# EasyEDA Pro project SchadenDeck.eprj, board keebdeck_basic_faceplate
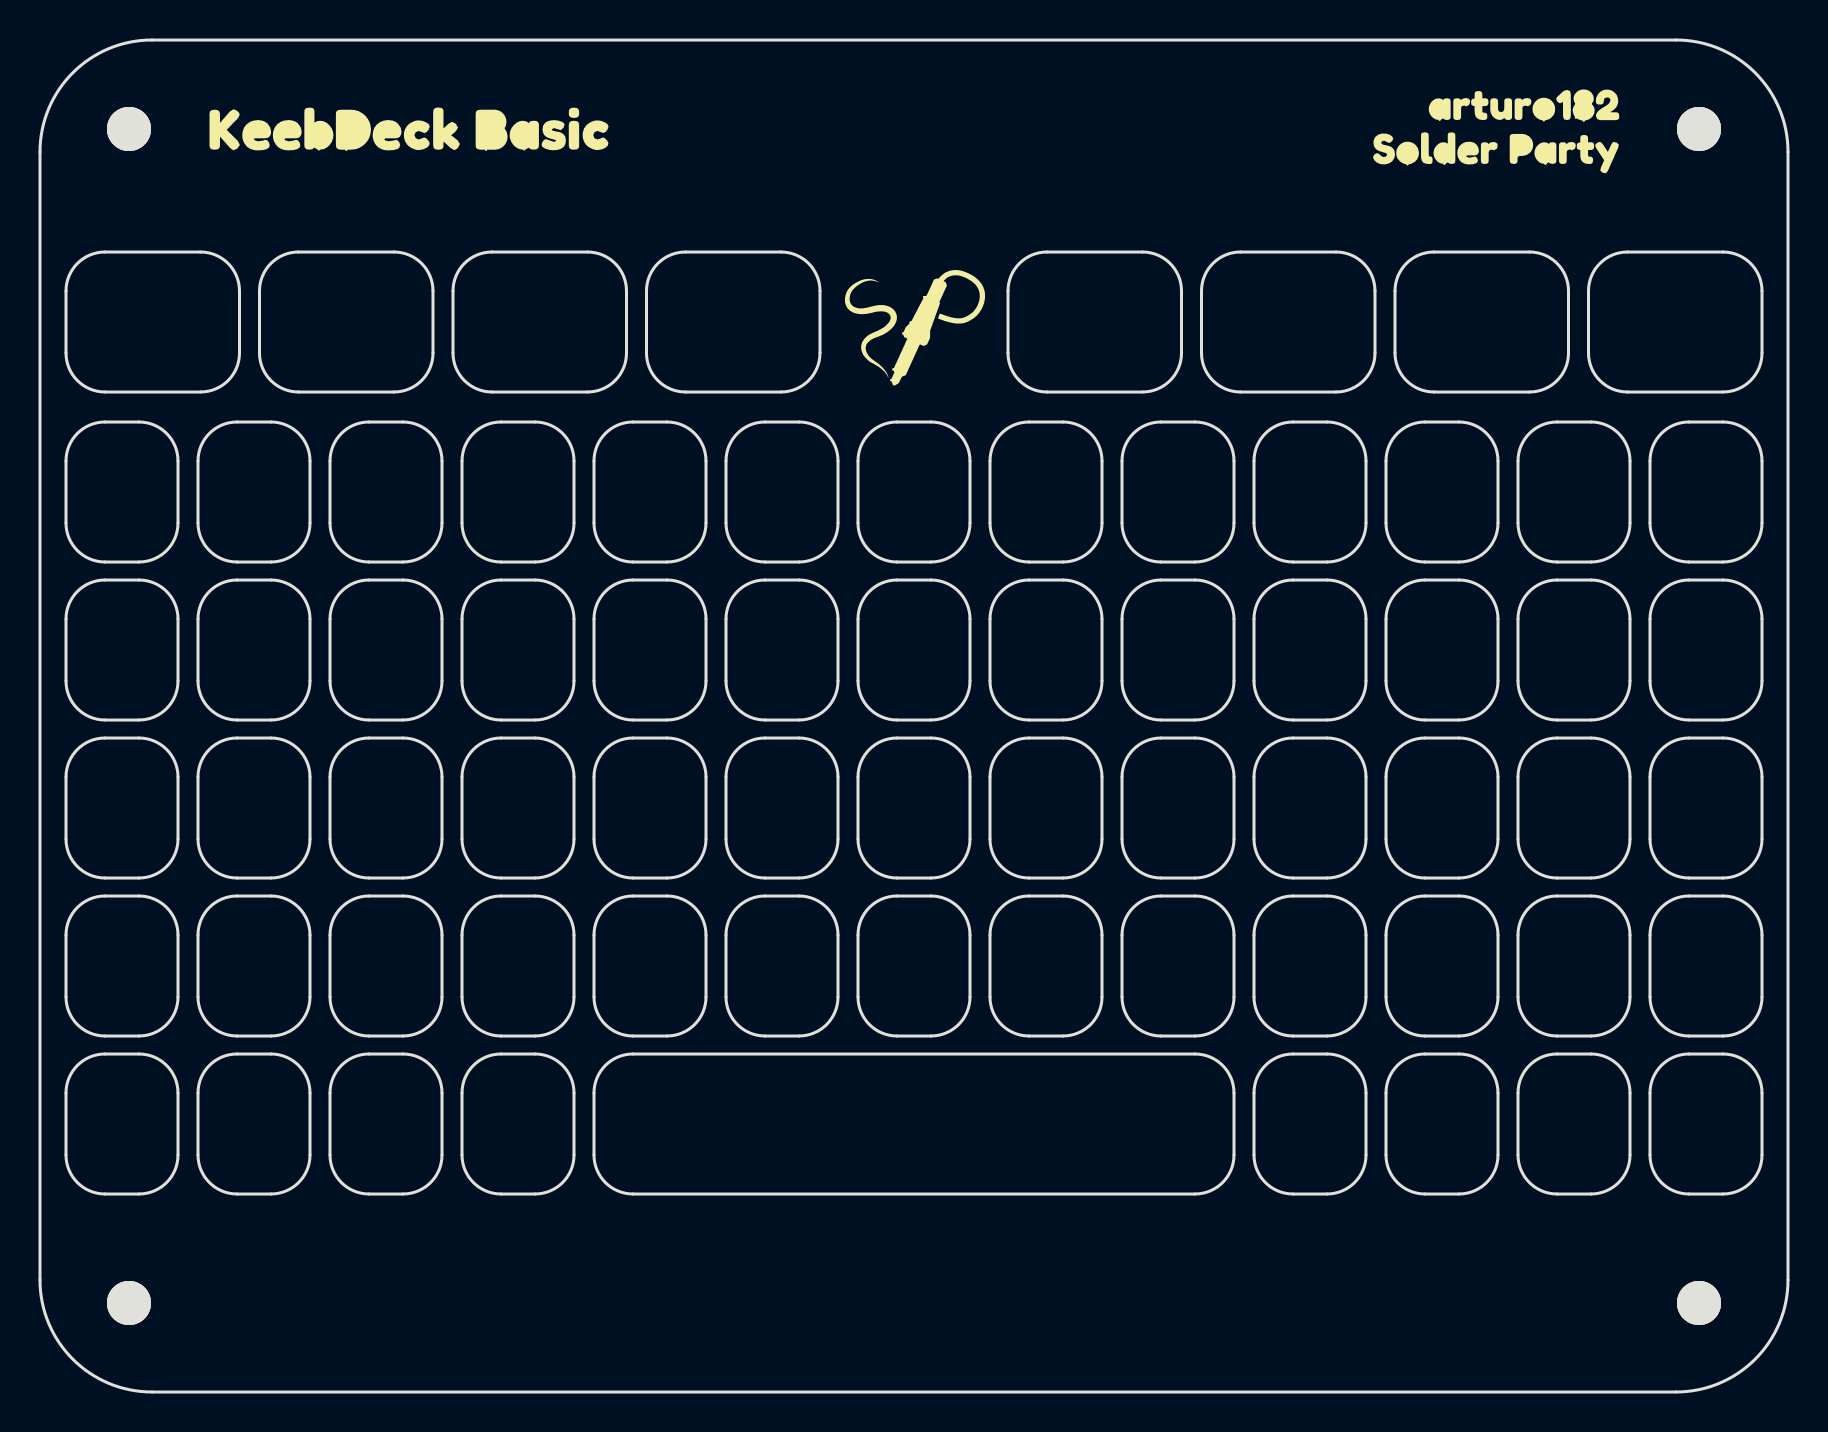
[diagram p6: board, top side]
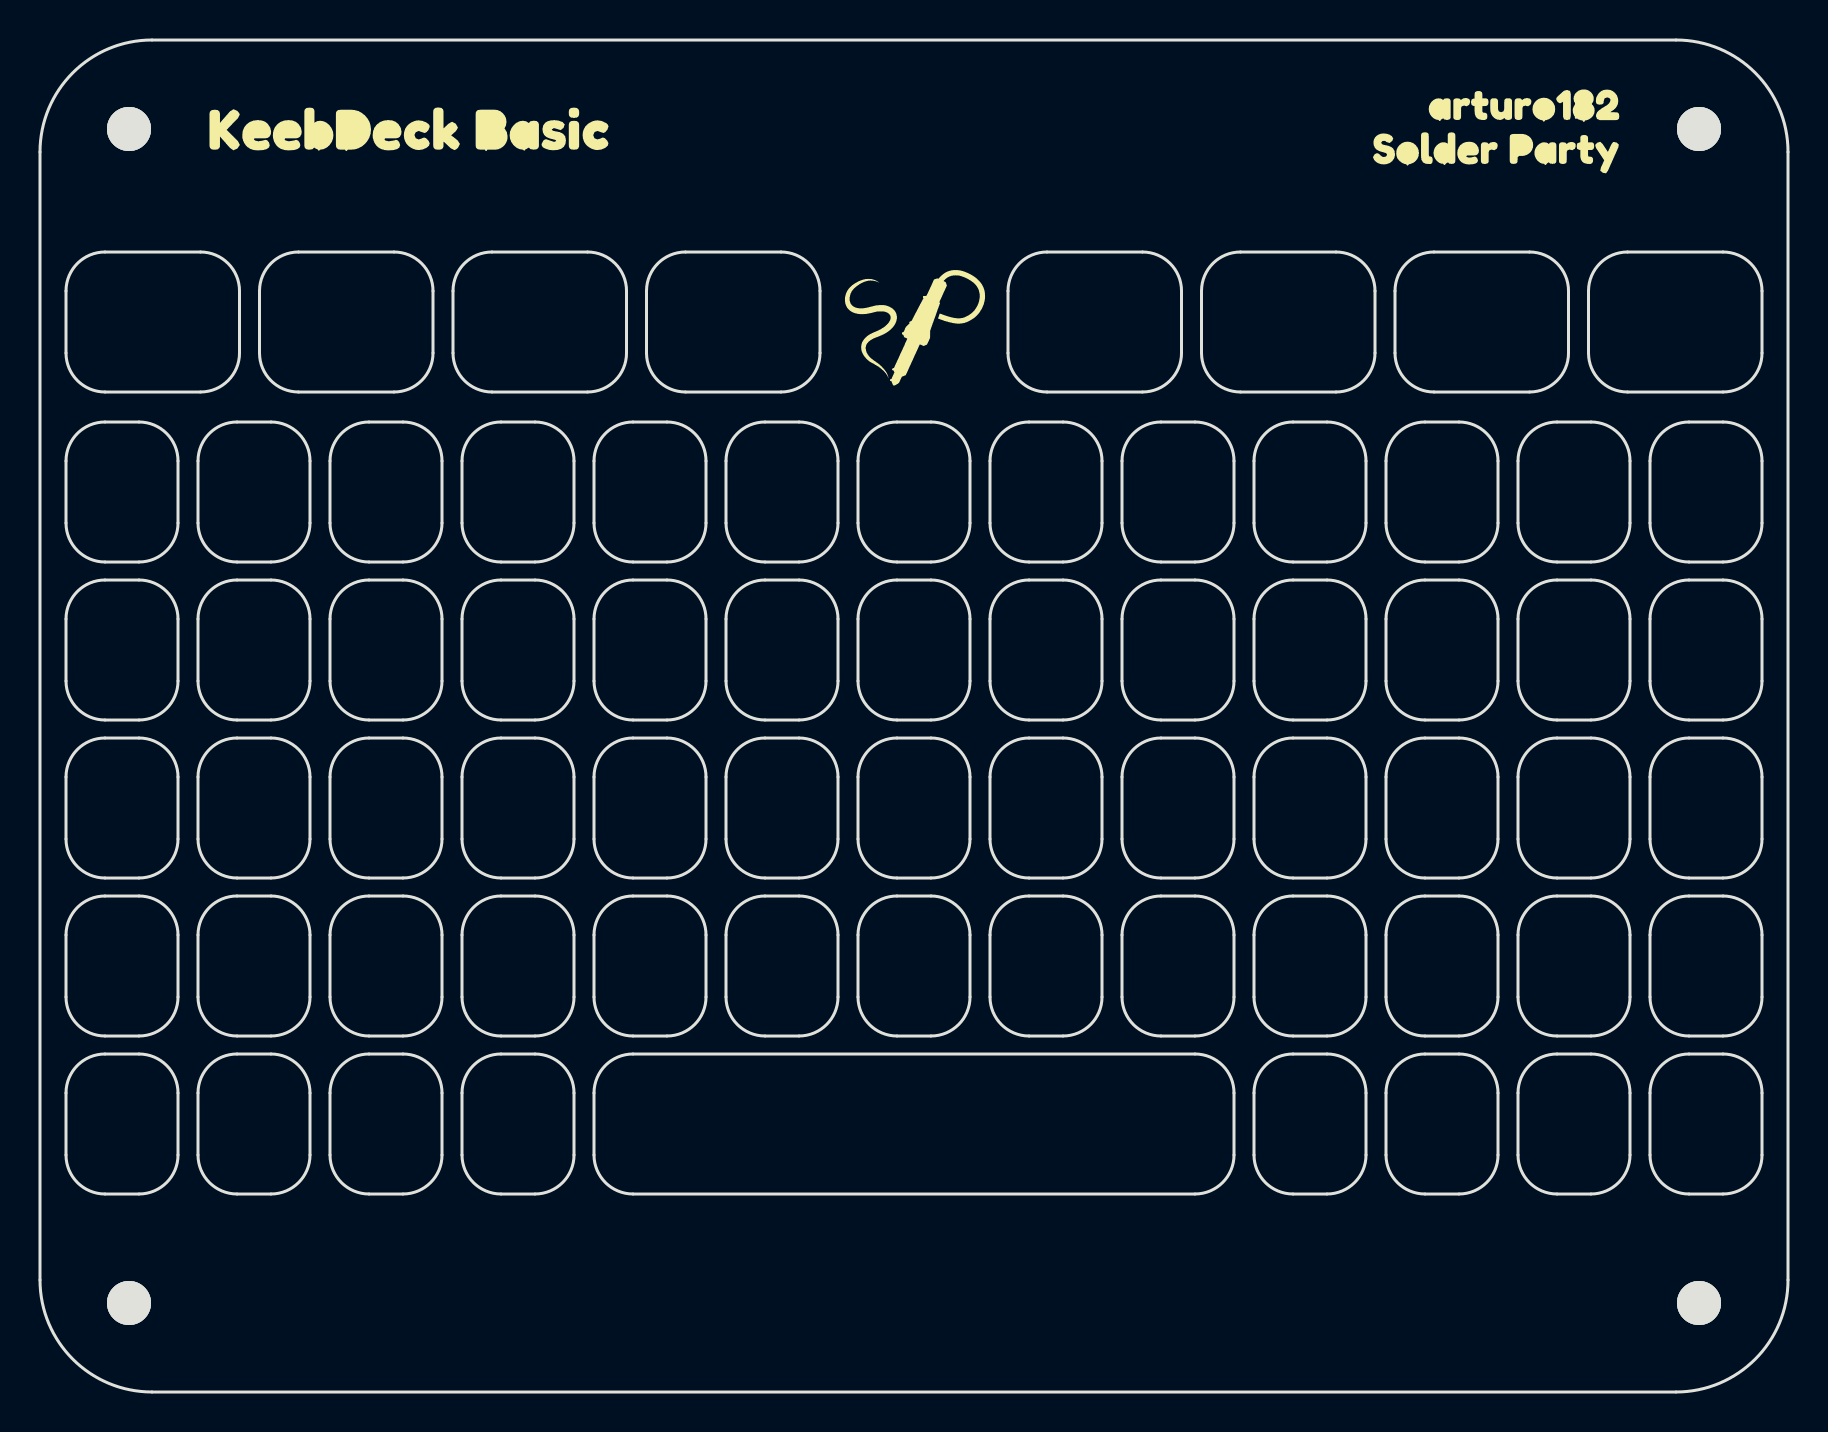
[diagram p7: board, bottom side, seen from below]

Outline 87.4 x 67.6 mm; copper layers: Top Layer, Bottom Layer. Coordinates in mm from the lower left corner of the outline.
Outline path: 0,62 arc(1.64,65.96) 5.6,67.6 81.8,67.6 arc(85.76,65.96) 87.4,62 87.4,5.6 arc(85.76,1.64) 81.8,0 5.6,0 arc(1.64,1.64) 0,5.6 0,62 ; 1.3,55.05 arc(1.87,56.43) 3.25,57 8.03,57 arc(9.4,56.43) 9.98,55.05 9.98,51.95 arc(9.4,50.57) 8.03,50 3.25,50 arc(1.87,50.57) 1.3,51.95 1.3,55.05 ; 1.3,46.55 arc(1.87,47.93) 3.25,48.5 4.95,48.5 arc(6.33,47.93) 6.9,46.55 6.9,43.45 arc(6.33,42.07) 4.95,41.5 3.25,41.5 arc(1.87,42.07) 1.3,43.45 1.3,46.55 ; 1.3,38.65 arc(1.87,40.03) 3.25,40.6 4.95,40.6 arc(6.33,40.03) 6.9,38.65 6.9,35.55 arc(6.33,34.17) 4.95,33.6 3.25,33.6 arc(1.87,34.17) 1.3,35.55 1.3,38.65 ; 1.3,30.75 arc(1.87,32.13) 3.25,32.7 4.95,32.7 arc(6.33,32.13) 6.9,30.75 6.9,27.65 arc(6.33,26.27) 4.95,25.7 3.25,25.7 arc(1.87,26.27) 1.3,27.65 1.3,30.75 ; 1.3,22.85 arc(1.87,24.23) 3.25,24.8 4.95,24.8 arc(6.33,24.23) 6.9,22.85 6.9,19.75 arc(6.33,18.37) 4.95,17.8 3.25,17.8 arc(1.87,18.37) 1.3,19.75 1.3,22.85 ; 1.3,14.95 arc(1.87,16.33) 3.25,16.9 4.95,16.9 arc(6.33,16.33) 6.9,14.95 6.9,11.85 arc(6.33,10.47) 4.95,9.9 3.25,9.9 arc(1.87,10.47) 1.3,11.85 1.3,14.95 ; 7.9,46.55 arc(8.47,47.93) 9.85,48.5 11.55,48.5 arc(12.93,47.93) 13.5,46.55 13.5,43.45 arc(12.93,42.07) 11.55,41.5 9.85,41.5 arc(8.47,42.07) 7.9,43.45 7.9,46.55 ; 7.9,38.65 arc(8.47,40.03) 9.85,40.6 11.55,40.6 arc(12.93,40.03) 13.5,38.65 13.5,35.55 arc(12.93,34.17) 11.55,33.6 9.85,33.6 arc(8.47,34.17) 7.9,35.55 7.9,38.65 ; 7.9,30.75 arc(8.47,32.13) 9.85,32.7 11.55,32.7 arc(12.93,32.13) 13.5,30.75 13.5,27.65 arc(12.93,26.27) 11.55,25.7 9.85,25.7 arc(8.47,26.27) 7.9,27.65 7.9,30.75 ; 7.9,22.85 arc(8.47,24.23) 9.85,24.8 11.55,24.8 arc(12.93,24.23) 13.5,22.85 13.5,19.75 arc(12.93,18.37) 11.55,17.8 9.85,17.8 arc(8.47,18.37) 7.9,19.75 7.9,22.85 ; 7.9,14.95 arc(8.47,16.33) 9.85,16.9 11.55,16.9 arc(12.93,16.33) 13.5,14.95 13.5,11.85 arc(12.93,10.47) 11.55,9.9 9.85,9.9 arc(8.47,10.47) 7.9,11.85 7.9,14.95 ; 10.98,55.05 arc(11.55,56.43) 12.93,57 17.7,57 arc(19.08,56.43) 19.65,55.05 19.65,51.95 arc(19.08,50.57) 17.7,50 12.93,50 arc(11.55,50.57) 10.98,51.95 10.98,55.05 ; 14.5,46.55 arc(15.07,47.93) 16.45,48.5 18.15,48.5 arc(19.53,47.93) 20.1,46.55 20.1,43.45 arc(19.53,42.07) 18.15,41.5 16.45,41.5 arc(15.07,42.07) 14.5,43.45 14.5,46.55 ; 14.5,38.65 arc(15.07,40.03) 16.45,40.6 18.15,40.6 arc(19.53,40.03) 20.1,38.65 20.1,35.55 arc(19.53,34.17) 18.15,33.6 16.45,33.6 arc(15.07,34.17) 14.5,35.55 14.5,38.65 ; 14.5,30.75 arc(15.07,32.13) 16.45,32.7 18.15,32.7 arc(19.53,32.13) 20.1,30.75 20.1,27.65 arc(19.53,26.27) 18.15,25.7 16.45,25.7 arc(15.07,26.27) 14.5,27.65 14.5,30.75 ; 14.5,22.85 arc(15.07,24.23) 16.45,24.8 18.15,24.8 arc(19.53,24.23) 20.1,22.85 20.1,19.75 arc(19.53,18.37) 18.15,17.8 16.45,17.8 arc(15.07,18.37) 14.5,19.75 14.5,22.85 ; 14.5,14.95 arc(15.07,16.33) 16.45,16.9 18.15,16.9 arc(19.53,16.33) 20.1,14.95 20.1,11.85 arc(19.53,10.47) 18.15,9.9 16.45,9.9 arc(15.07,10.47) 14.5,11.85 14.5,14.95 ; 20.65,55.05 arc(21.22,56.43) 22.6,57 27.38,57 arc(28.75,56.43) 29.33,55.05 29.33,51.95 arc(28.75,50.57) 27.38,50 22.6,50 arc(21.22,50.57) 20.65,51.95 20.65,55.05 ; 21.1,46.55 arc(21.67,47.93) 23.05,48.5 24.75,48.5 arc(26.13,47.93) 26.7,46.55 26.7,43.45 arc(26.13,42.07) 24.75,41.5 23.05,41.5 arc(21.67,42.07) 21.1,43.45 21.1,46.55 ; 21.1,38.65 arc(21.67,40.03) 23.05,40.6 24.75,40.6 arc(26.13,40.03) 26.7,38.65 26.7,35.55 arc(26.13,34.17) 24.75,33.6 23.05,33.6 arc(21.67,34.17) 21.1,35.55 21.1,38.65 ; 21.1,30.75 arc(21.67,32.13) 23.05,32.7 24.75,32.7 arc(26.13,32.13) 26.7,30.75 26.7,27.65 arc(26.13,26.27) 24.75,25.7 23.05,25.7 arc(21.67,26.27) 21.1,27.65 21.1,30.75 ; 21.1,22.85 arc(21.67,24.23) 23.05,24.8 24.75,24.8 arc(26.13,24.23) 26.7,22.85 26.7,19.75 arc(26.13,18.37) 24.75,17.8 23.05,17.8 arc(21.67,18.37) 21.1,19.75 21.1,22.85 ; 21.1,14.95 arc(21.67,16.33) 23.05,16.9 24.75,16.9 arc(26.13,16.33) 26.7,14.95 26.7,11.85 arc(26.13,10.47) 24.75,9.9 23.05,9.9 arc(21.67,10.47) 21.1,11.85 21.1,14.95 ; 27.7,46.55 arc(28.27,47.93) 29.65,48.5 31.35,48.5 arc(32.73,47.93) 33.3,46.55 33.3,43.45 arc(32.73,42.07) 31.35,41.5 29.65,41.5 arc(28.27,42.07) 27.7,43.45 27.7,46.55 ; 27.7,38.65 arc(28.27,40.03) 29.65,40.6 31.35,40.6 arc(32.73,40.03) 33.3,38.65 33.3,35.55 arc(32.73,34.17) 31.35,33.6 29.65,33.6 arc(28.27,34.17) 27.7,35.55 27.7,38.65 ; 27.7,30.75 arc(28.27,32.13) 29.65,32.7 31.35,32.7 arc(32.73,32.13) 33.3,30.75 33.3,27.65 arc(32.73,26.27) 31.35,25.7 29.65,25.7 arc(28.27,26.27) 27.7,27.65 27.7,30.75 ; 27.7,22.85 arc(28.27,24.23) 29.65,24.8 31.35,24.8 arc(32.73,24.23) 33.3,22.85 33.3,19.75 arc(32.73,18.37) 31.35,17.8 29.65,17.8 arc(28.27,18.37) 27.7,19.75 27.7,22.85 ; 27.7,14.95 arc(28.27,16.33) 29.65,16.9 57.75,16.9 arc(59.13,16.33) 59.7,14.95 59.7,11.85 arc(59.13,10.47) 57.75,9.9 29.65,9.9 arc(28.27,10.47) 27.7,11.85 27.7,14.95 ; 30.33,55.05 arc(30.9,56.43) 32.28,57 37.05,57 arc(38.43,56.43) 39,55.05 39,51.95 arc(38.43,50.57) 37.05,50 32.28,50 arc(30.9,50.57) 30.33,51.95 30.33,55.05 ; 34.3,46.55 arc(34.87,47.93) 36.25,48.5 37.95,48.5 arc(39.33,47.93) 39.9,46.55 39.9,43.45 arc(39.33,42.07) 37.95,41.5 36.25,41.5 arc(34.87,42.07) 34.3,43.45 34.3,46.55 ; 34.3,38.65 arc(34.87,40.03) 36.25,40.6 37.95,40.6 arc(39.33,40.03) 39.9,38.65 39.9,35.55 arc(39.33,34.17) 37.95,33.6 36.25,33.6 arc(34.87,34.17) 34.3,35.55 34.3,38.65 ; 34.3,30.75 arc(34.87,32.13) 36.25,32.7 37.95,32.7 arc(39.33,32.13) 39.9,30.75 39.9,27.65 arc(39.33,26.27) 37.95,25.7 36.25,25.7 arc(34.87,26.27) 34.3,27.65 34.3,30.75 ; 34.3,22.85 arc(34.87,24.23) 36.25,24.8 37.95,24.8 arc(39.33,24.23) 39.9,22.85 39.9,19.75 arc(39.33,18.37) 37.95,17.8 36.25,17.8 arc(34.87,18.37) 34.3,19.75 34.3,22.85 ; 40.9,46.55 arc(41.47,47.93) 42.85,48.5 44.55,48.5 arc(45.93,47.93) 46.5,46.55 46.5,43.45 arc(45.93,42.07) 44.55,41.5 42.85,41.5 arc(41.47,42.07) 40.9,43.45 40.9,46.55 ; 40.9,38.65 arc(41.47,40.03) 42.85,40.6 44.55,40.6 arc(45.93,40.03) 46.5,38.65 46.5,35.55 arc(45.93,34.17) 44.55,33.6 42.85,33.6 arc(41.47,34.17) 40.9,35.55 40.9,38.65 ; 40.9,30.75 arc(41.47,32.13) 42.85,32.7 44.55,32.7 arc(45.93,32.13) 46.5,30.75 46.5,27.65 arc(45.93,26.27) 44.55,25.7 42.85,25.7 arc(41.47,26.27) 40.9,27.65 40.9,30.75 ; 40.9,22.85 arc(41.47,24.23) 42.85,24.8 44.55,24.8 arc(45.93,24.23) 46.5,22.85 46.5,19.75 arc(45.93,18.37) 44.55,17.8 42.85,17.8 arc(41.47,18.37) 40.9,19.75 40.9,22.85 ; 47.5,46.55 arc(48.07,47.93) 49.45,48.5 51.15,48.5 arc(52.53,47.93) 53.1,46.55 53.1,43.45 arc(52.53,42.07) 51.15,41.5 49.45,41.5 arc(48.07,42.07) 47.5,43.45 47.5,46.55 ; 47.5,38.65 arc(48.07,40.03) 49.45,40.6 51.15,40.6 arc(52.53,40.03) 53.1,38.65 53.1,35.55 arc(52.53,34.17) 51.15,33.6 49.45,33.6 arc(48.07,34.17) 47.5,35.55 47.5,38.65 ; 47.5,30.75 arc(48.07,32.13) 49.45,32.7 51.15,32.7 arc(52.53,32.13) 53.1,30.75 53.1,27.65 arc(52.53,26.27) 51.15,25.7 49.45,25.7 arc(48.07,26.27) 47.5,27.65 47.5,30.75 ; 47.5,22.85 arc(48.07,24.23) 49.45,24.8 51.15,24.8 arc(52.53,24.23) 53.1,22.85 53.1,19.75 arc(52.53,18.37) 51.15,17.8 49.45,17.8 arc(48.07,18.37) 47.5,19.75 47.5,22.85 ; 48.4,55.05 arc(48.97,56.43) 50.35,57 55.13,57 arc(56.5,56.43) 57.08,55.05 57.08,51.95 arc(56.5,50.57) 55.13,50 50.35,50 arc(48.97,50.57) 48.4,51.95 48.4,55.05 ; 54.1,46.55 arc(54.67,47.93) 56.05,48.5 57.75,48.5 arc(59.13,47.93) 59.7,46.55 59.7,43.45 arc(59.13,42.07) 57.75,41.5 56.05,41.5 arc(54.67,42.07) 54.1,43.45 54.1,46.55 ; 54.1,38.65 arc(54.67,40.03) 56.05,40.6 57.75,40.6 arc(59.13,40.03) 59.7,38.65 59.7,35.55 arc(59.13,34.17) 57.75,33.6 56.05,33.6 arc(54.67,34.17) 54.1,35.55 54.1,38.65 ; 54.1,30.75 arc(54.67,32.13) 56.05,32.7 57.75,32.7 arc(59.13,32.13) 59.7,30.75 59.7,27.65 arc(59.13,26.27) 57.75,25.7 56.05,25.7 arc(54.67,26.27) 54.1,27.65 54.1,30.75 ; 54.1,22.85 arc(54.67,24.23) 56.05,24.8 57.75,24.8 arc(59.13,24.23) 59.7,22.85 59.7,19.75 arc(59.13,18.37) 57.75,17.8 56.05,17.8 arc(54.67,18.37) 54.1,19.75 54.1,22.85 ; 58.08,55.05 arc(58.65,56.43) 60.03,57 64.8,57 arc(66.18,56.43) 66.75,55.05 66.75,51.95 arc(66.18,50.57) 64.8,50 60.03,50 arc(58.65,50.57) 58.08,51.95 58.08,55.05 ; 60.7,46.55 arc(61.27,47.93) 62.65,48.5 64.35,48.5 arc(65.73,47.93) 66.3,46.55 66.3,43.45 arc(65.73,42.07) 64.35,41.5 62.65,41.5 arc(61.27,42.07) 60.7,43.45 60.7,46.55 ; 60.7,38.65 arc(61.27,40.03) 62.65,40.6 64.35,40.6 arc(65.73,40.03) 66.3,38.65 66.3,35.55 arc(65.73,34.17) 64.35,33.6 62.65,33.6 arc(61.27,34.17) 60.7,35.55 60.7,38.65 ; 60.7,30.75 arc(61.27,32.13) 62.65,32.7 64.35,32.7 arc(65.73,32.13) 66.3,30.75 66.3,27.65 arc(65.73,26.27) 64.35,25.7 62.65,25.7 arc(61.27,26.27) 60.7,27.65 60.7,30.75 ; 60.7,22.85 arc(61.27,24.23) 62.65,24.8 64.35,24.8 arc(65.73,24.23) 66.3,22.85 66.3,19.75 arc(65.73,18.37) 64.35,17.8 62.65,17.8 arc(61.27,18.37) 60.7,19.75 60.7,22.85 ; 60.7,14.95 arc(61.27,16.33) 62.65,16.9 64.35,16.9 arc(65.73,16.33) 66.3,14.95 66.3,11.85 arc(65.73,10.47) 64.35,9.9 62.65,9.9 arc(61.27,10.47) 60.7,11.85 60.7,14.95 ; 67.3,46.55 arc(67.87,47.93) 69.25,48.5 70.95,48.5 arc(72.33,47.93) 72.9,46.55 72.9,43.45 arc(72.33,42.07) 70.95,41.5 69.25,41.5 arc(67.87,42.07) 67.3,43.45 67.3,46.55 ; 67.3,38.65 arc(67.87,40.03) 69.25,40.6 70.95,40.6 arc(72.33,40.03) 72.9,38.65 72.9,35.55 arc(72.33,34.17) 70.95,33.6 69.25,33.6 arc(67.87,34.17) 67.3,35.55 67.3,38.65 ; 67.3,30.75 arc(67.87,32.13) 69.25,32.7 70.95,32.7 arc(72.33,32.13) 72.9,30.75 72.9,27.65 arc(72.33,26.27) 70.95,25.7 69.25,25.7 arc(67.87,26.27) 67.3,27.65 67.3,30.75 ; 67.3,22.85 arc(67.87,24.23) 69.25,24.8 70.95,24.8 arc(72.33,24.23) 72.9,22.85 72.9,19.75 arc(72.33,18.37) 70.95,17.8 69.25,17.8 arc(67.87,18.37) 67.3,19.75 67.3,22.85 ; 67.3,14.95 arc(67.87,16.33) 69.25,16.9 70.95,16.9 arc(72.33,16.33) 72.9,14.95 72.9,11.85 arc(72.33,10.47) 70.95,9.9 69.25,9.9 arc(67.87,10.47) 67.3,11.85 67.3,14.95 ; 67.75,55.05 arc(68.32,56.43) 69.7,57 74.48,57 arc(75.85,56.43) 76.43,55.05 76.43,51.95 arc(75.85,50.57) 74.48,50 69.7,50 arc(68.32,50.57) 67.75,51.95 67.75,55.05 ; 73.9,46.55 arc(74.47,47.93) 75.85,48.5 77.55,48.5 arc(78.93,47.93) 79.5,46.55 79.5,43.45 arc(78.93,42.07) 77.55,41.5 75.85,41.5 arc(74.47,42.07) 73.9,43.45 73.9,46.55 ; 73.9,38.65 arc(74.47,40.03) 75.85,40.6 77.55,40.6 arc(78.93,40.03) 79.5,38.65 79.5,35.55 arc(78.93,34.17) 77.55,33.6 75.85,33.6 arc(74.47,34.17) 73.9,35.55 73.9,38.65 ; 73.9,30.75 arc(74.47,32.13) 75.85,32.7 77.55,32.7 arc(78.93,32.13) 79.5,30.75 79.5,27.65 arc(78.93,26.27) 77.55,25.7 75.85,25.7 arc(74.47,26.27) 73.9,27.65 73.9,30.75 ; 73.9,22.85 arc(74.47,24.23) 75.85,24.8 77.55,24.8 arc(78.93,24.23) 79.5,22.85 79.5,19.75 arc(78.93,18.37) 77.55,17.8 75.85,17.8 arc(74.47,18.37) 73.9,19.75 73.9,22.85 ; 73.9,14.95 arc(74.47,16.33) 75.85,16.9 77.55,16.9 arc(78.93,16.33) 79.5,14.95 79.5,11.85 arc(78.93,10.47) 77.55,9.9 75.85,9.9 arc(74.47,10.47) 73.9,11.85 73.9,14.95 ; 77.43,55.05 arc(78,56.43) 79.38,57 84.15,57 arc(85.53,56.43) 86.1,55.05 86.1,51.95 arc(85.53,50.57) 84.15,50 79.38,50 arc(78,50.57) 77.43,51.95 77.43,55.05 ; 80.5,46.55 arc(81.07,47.93) 82.45,48.5 84.15,48.5 arc(85.53,47.93) 86.1,46.55 86.1,43.45 arc(85.53,42.07) 84.15,41.5 82.45,41.5 arc(81.07,42.07) 80.5,43.45 80.5,46.55 ; 80.5,38.65 arc(81.07,40.03) 82.45,40.6 84.15,40.6 arc(85.53,40.03) 86.1,38.65 86.1,35.55 arc(85.53,34.17) 84.15,33.6 82.45,33.6 arc(81.07,34.17) 80.5,35.55 80.5,38.65 ; 80.5,30.75 arc(81.07,32.13) 82.45,32.7 84.15,32.7 arc(85.53,32.13) 86.1,30.75 86.1,27.65 arc(85.53,26.27) 84.15,25.7 82.45,25.7 arc(81.07,26.27) 80.5,27.65 80.5,30.75 ; 80.5,22.85 arc(81.07,24.23) 82.45,24.8 84.15,24.8 arc(85.53,24.23) 86.1,22.85 86.1,19.75 arc(85.53,18.37) 84.15,17.8 82.45,17.8 arc(81.07,18.37) 80.5,19.75 80.5,22.85 ; 80.5,14.95 arc(81.07,16.33) 82.45,16.9 84.15,16.9 arc(85.53,16.33) 86.1,14.95 86.1,11.85 arc(85.53,10.47) 84.15,9.9 82.45,9.9 arc(81.07,10.47) 80.5,11.85 80.5,14.95
Stack: Top Layer 0.0009mm / dielectric 1 0.0384mm FR4 er 4.5 / Bottom Layer 0.0009mm

## Design rules (mm)
net +3.3V uses CopperRegion
net Net-(D1-A) uses CopperRegion1
net GND uses CopperRegion3

## Placement (name value [footprint] x y rotation side)
G***  -  [Symbols_Extra:SolderParty-New-Logo_7.5x6.4mm_SilkScreen]  43.99 53.45 0 top
G***#2  -  [Symbols_Extra:SolderParty-New-Logo_7.5x6.4mm_SilkScreen]  43.41 53.45 180 bottom
kibuzzard-678C4B7D  -  [kibuzzard-678C4B7D]  72.8 61.95 0 top
kibuzzard-678C4B7D#2  -  [kibuzzard-678C4B7D]  14.6 61.95 180 bottom
kibuzzard-678C4B8E  -  [kibuzzard-678C4B8E]  74.2 64.35 0 top
kibuzzard-678C4B8E#2  -  [kibuzzard-678C4B8E]  13.2 64.35 180 bottom
kibuzzard-678C4B38  -  [kibuzzard-678C4B38]  18.5 63.15 0 top
kibuzzard-678C4B38#2  -  [kibuzzard-678C4B38]  68.9 63.15 180 bottom
REF**  -  [MountingHole:MountingHole_2.2mm_M2]  4.45 63.15 0 top
REF**#2  -  [MountingHole:MountingHole_2.2mm_M2]  82.95 4.45 0 top
REF**#3  -  [MountingHole:MountingHole_2.2mm_M2]  82.95 63.15 0 top
REF**#4  -  [MountingHole:MountingHole_2.2mm_M2]  4.45 4.45 0 top

## Footprints (pads in the part's own frame, mm; a bottom-side part is the same pattern mirrored in y, then rotated)
MountingHole:MountingHole_2.2mm_M2
  round 2.2 hole 2.2: (0,0)

## Nets
